# EAGLE schematic UniversalPPU (EAGLE 6.5.0)

## Sheet 1 of 6
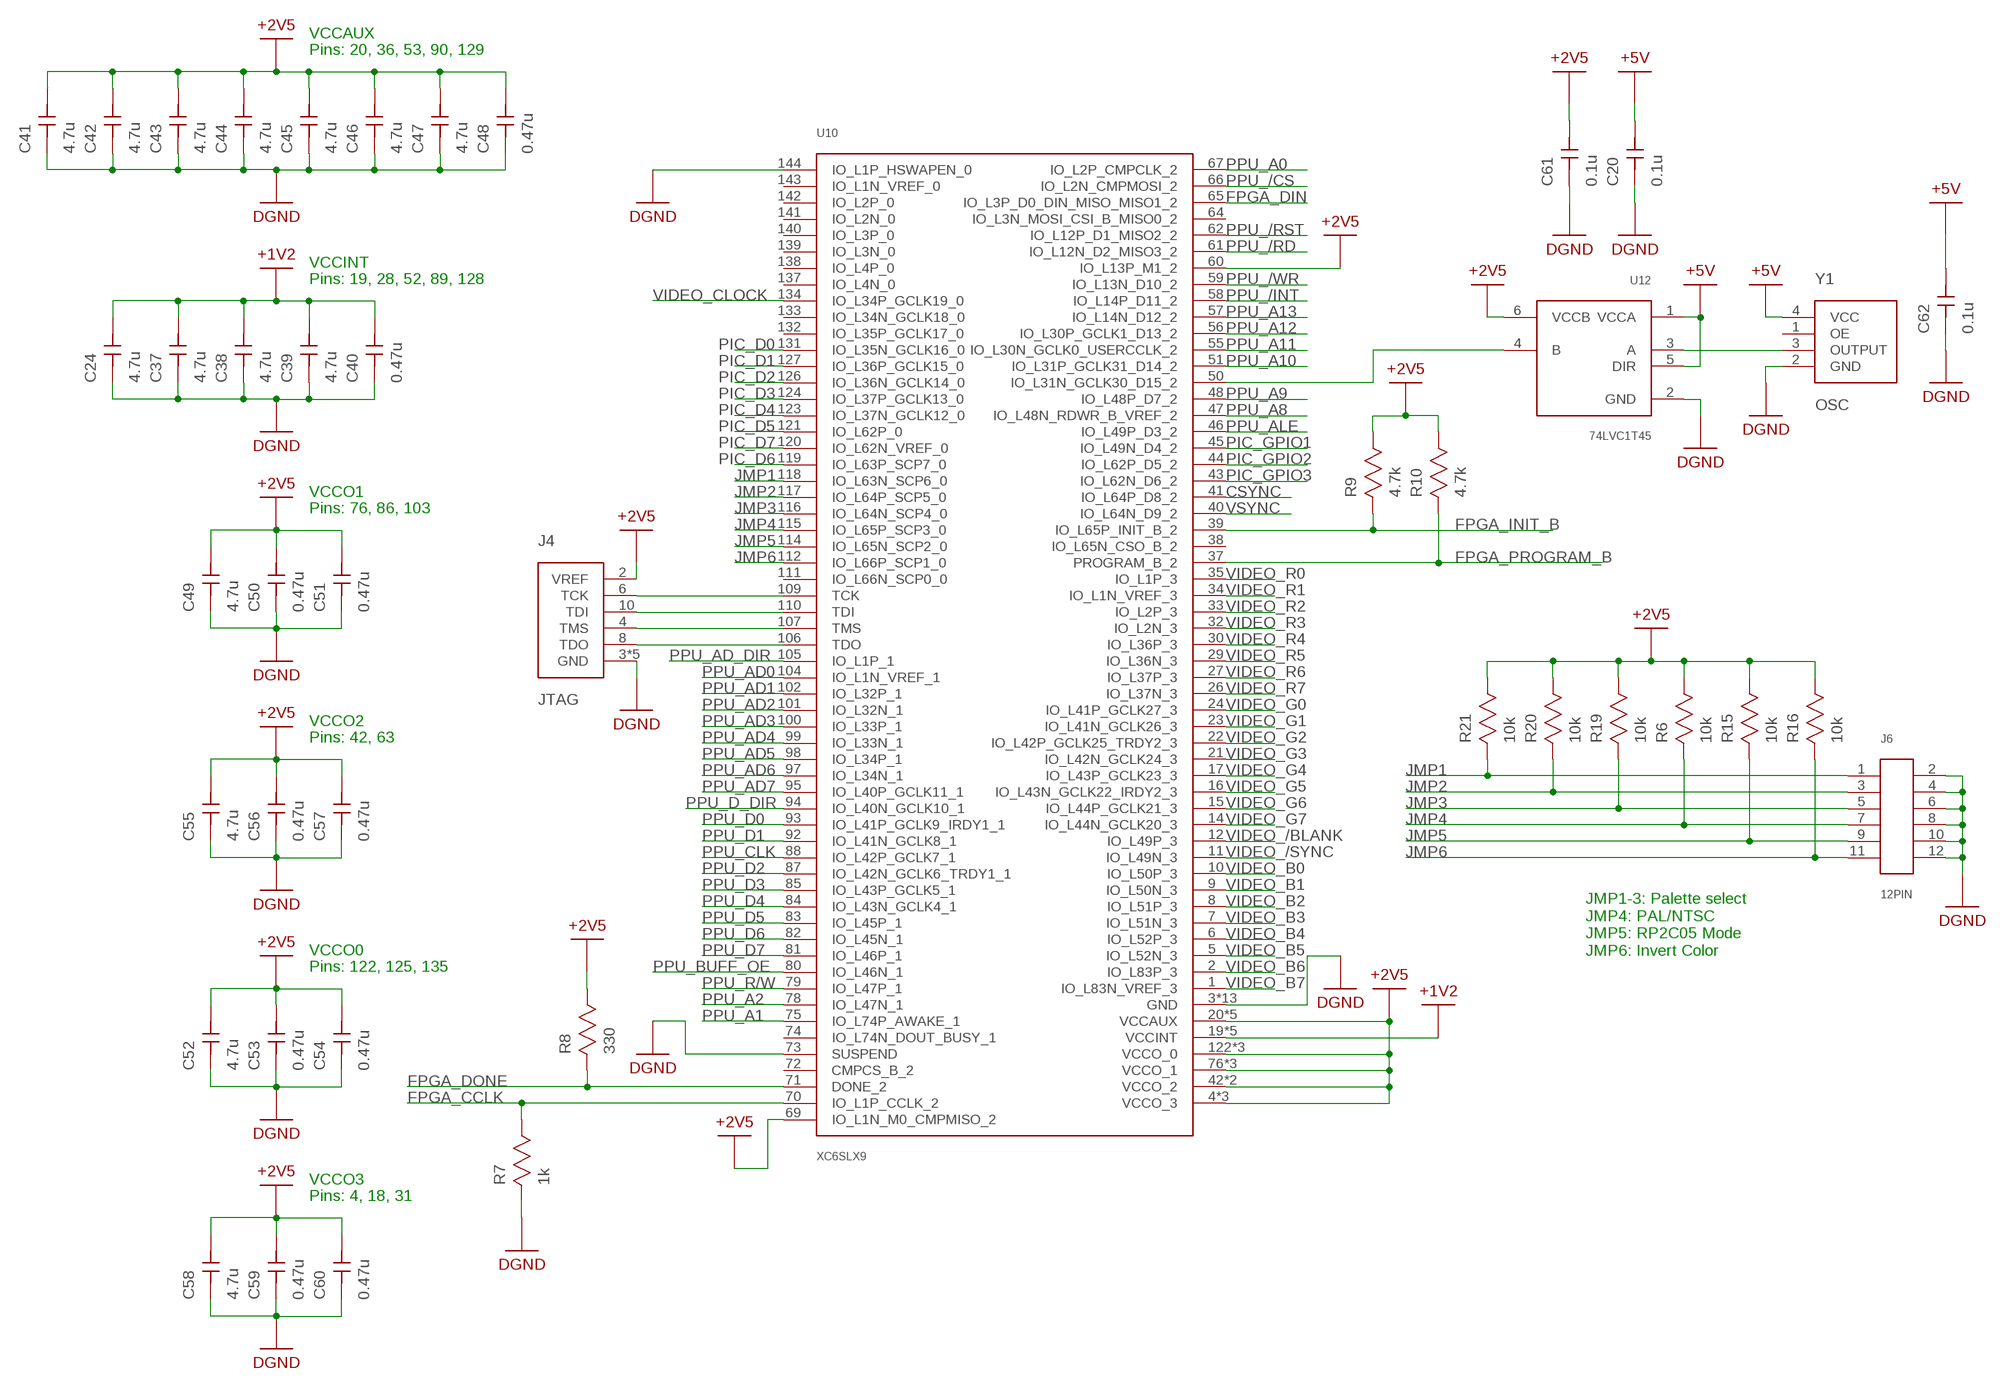
[diagram p0: schematic, sheet 1]

### Parts
C20  0.1u  CAPACITORTDK_C0816  [TDK_C0816]
C24  4.7u  CAPACITORTDK_C0816  [TDK_C0816]
C37  4.7u  CAPACITORTDK_C0816  [TDK_C0816]
C38  4.7u  CAPACITORTDK_C0816  [TDK_C0816]
C39  4.7u  CAPACITORTDK_C0816  [TDK_C0816]
C40  0.47u  CAPACITORTDK_C0816  [TDK_C0816]
C41  4.7u  CAPACITORTDK_C0816  [TDK_C0816]
C42  4.7u  CAPACITORTDK_C0816  [TDK_C0816]
C43  4.7u  CAPACITORTDK_C0816  [TDK_C0816]
C44  4.7u  CAPACITORTDK_C0816  [TDK_C0816]
C45  4.7u  CAPACITORTDK_C0816  [TDK_C0816]
C46  4.7u  CAPACITORTDK_C0816  [TDK_C0816]
C47  4.7u  CAPACITORTDK_C0816  [TDK_C0816]
C48  0.47u  CAPACITORTDK_C0816  [TDK_C0816]
C49  4.7u  CAPACITORTDK_C0816  [TDK_C0816]
C50  0.47u  CAPACITORTDK_C0816  [TDK_C0816]
C51  0.47u  CAPACITORTDK_C0816  [TDK_C0816]
C52  4.7u  CAPACITORTDK_C0816  [TDK_C0816]
C53  0.47u  CAPACITORTDK_C0816  [TDK_C0816]
C54  0.47u  CAPACITORTDK_C0816  [TDK_C0816]
C55  4.7u  CAPACITORTDK_C0816  [TDK_C0816]
C56  0.47u  CAPACITORTDK_C0816  [TDK_C0816]
C57  0.47u  CAPACITORTDK_C0816  [TDK_C0816]
C58  4.7u  CAPACITORTDK_C0816  [TDK_C0816]
C59  0.47u  CAPACITORTDK_C0816  [TDK_C0816]
C60  0.47u  CAPACITORTDK_C0816  [TDK_C0816]
C61  0.1u  CAPACITORTDK_C0816  [TDK_C0816]
C62  0.1u  CAPACITORTDK_C0816  [TDK_C0816]
J4  JTAG  [14PIN_2MM]
J6  12PIN  [12PIN]
R6  10k  RESISTOR0603  [0603]
R7  1k  RESISTOR0603  [0603]
R8  330  RESISTOR0603  [0603]
R9  4.7k  RESISTOR0603  [0603]
R10  4.7k  RESISTOR0603  [0603]
R15  10k  RESISTOR0603  [0603]
R16  10k  RESISTOR0603  [0603]
R19  10k  RESISTOR0603  [0603]
R20  10k  RESISTOR0603  [0603]
R21  10k  RESISTOR0603  [0603]
U10  XC6SLX9  [TQG144]
U12  74LVC1T45  [R-PDSO-G6]
Y1  OSC  [OSC]

### Nets
+1V2: C24.2 C37.2 C38.2 C39.2 C40.2 U10.19(VCCINT) U10.28(VCCINT) U10.52(VCCINT) U10.89(VCCINT) U10.128(VCCINT) ; also sheet 6
+2V5: C41.2 C42.2 C43.2 C44.2 C45.2 C46.2 C47.2 C48.2 C49.2 C50.2 C51.2 C52.2 C53.2 C54.2 C55.2 C56.2 C57.2 C58.2 C59.2 C60.2 C61.2 J4.2(VREF) R6.P$2 R8.P$2 R9.P$2 R10.P$2 R15.P$2 R16.P$2 R19.P$2 R20.P$2 R21.P$2 U10.4(VCCO_3) U10.18(VCCO_3) U10.20(VCCAUX) U10.31(VCCO_3) U10.36(VCCAUX) U10.42(VCCO_2) U10.53(VCCAUX) U10.60(IO_L13P_M1_2) U10.63(VCCO_2) U10.69(IO_L1N_M0_CMPMISO_2) U10.76(VCCO_1) U10.86(VCCO_1) U10.90(VCCAUX) U10.103(VCCO_1) U10.122(VCCO_0) U10.125(VCCO_0) U10.129(VCCAUX) U10.135(VCCO_0) U12.6(VCCB) ; also sheet 2,3,4,5,6
+5V: C20.2 C62.2 U12.1(VCCA) U12.5(DIR) Y1.4(VCC) ; also sheet 2,3,5,6
CSYNC: U10.41(IO_L64P_D8_2) ; also sheet 3
DGND: C20.1 C24.1 C37.1 C38.1 C39.1 C40.1 C41.1 C42.1 C43.1 C44.1 C45.1 C46.1 C47.1 C48.1 C49.1 C50.1 C51.1 C52.1 C53.1 C54.1 C55.1 C56.1 C57.1 C58.1 C59.1 C60.1 C61.1 C62.1 J4.3(GND) J4.5(GND) J4.7(GND) J4.9(GND) J4.11(GND) J6.2 J6.4 J6.6 J6.8 J6.10 J6.12 R7.P$1 U10.3(GND) U10.13(GND) U10.25(GND) U10.49(GND) U10.54(GND) U10.68(GND) U10.73(SUSPEND) U10.77(GND) U10.91(GND) U10.96(GND) U10.108(GND) U10.113(GND) U10.130(GND) U10.136(GND) U10.144(IO_L1P_HSWAPEN_0) U12.2(GND) Y1.2(GND) ; also sheet 2,3,4,5,6
FPGA_CCLK: R7.P$2 U10.70(IO_L1P_CCLK_2) ; also sheet 4
FPGA_DIN: U10.65(IO_L3P_D0_DIN_MISO_MISO1_2) ; also sheet 4
FPGA_DONE: R8.P$1 U10.71(DONE_2) ; also sheet 4
FPGA_INIT_B: R9.P$1 U10.39(IO_L65P_INIT_B_2) ; also sheet 4
FPGA_PROGRAM_B: R10.P$1 U10.37(PROGRAM_B_2) ; also sheet 4
JMP1: J6.1 R21.P$1 U10.118(IO_L63N_SCP6_0)
JMP2: J6.3 R20.P$1 U10.117(IO_L64P_SCP5_0)
JMP3: J6.5 R19.P$1 U10.116(IO_L64N_SCP4_0)
JMP4: J6.7 R6.P$1 U10.115(IO_L65P_SCP3_0)
JMP5: J6.9 R15.P$1 U10.114(IO_L65N_SCP2_0)
JMP6: J6.11 R16.P$1 U10.112(IO_L66P_SCP1_0)
N$3: U10.50(IO_L31N_GCLK30_D15_2) U12.4(B)
N$23: U12.3(A) Y1.3(OUTPUT)
PIC_D0: U10.131(IO_L35N_GCLK16_0) ; also sheet 4
PIC_D1: U10.127(IO_L36P_GCLK15_0) ; also sheet 4
PIC_D2: U10.126(IO_L36N_GCLK14_0) ; also sheet 4
PIC_D3: U10.124(IO_L37P_GCLK13_0) ; also sheet 4
PIC_D4: U10.123(IO_L37N_GCLK12_0) ; also sheet 4
PIC_D5: U10.121(IO_L62P_0) ; also sheet 4
PIC_D6: U10.119(IO_L63P_SCP7_0) ; also sheet 4
PIC_D7: U10.120(IO_L62N_VREF_0) ; also sheet 4
PIC_GPIO1: U10.45(IO_L49N_D4_2) ; also sheet 4
PIC_GPIO2: U10.44(IO_L62P_D5_2) ; also sheet 4
PIC_GPIO3: U10.43(IO_L62N_D6_2) ; also sheet 4
PPU_/CS: U10.66(IO_L2N_CMPMOSI_2) ; also sheet 2
PPU_/INT: U10.58(IO_L14P_D11_2) ; also sheet 2
PPU_/RD: U10.61(IO_L12N_D2_MISO3_2) ; also sheet 2
PPU_/RST: U10.62(IO_L12P_D1_MISO2_2) ; also sheet 2
PPU_/WR: U10.59(IO_L13N_D10_2) ; also sheet 2
PPU_A0: U10.67(IO_L2P_CMPCLK_2) ; also sheet 2
PPU_A1: U10.75(IO_L74P_AWAKE_1) ; also sheet 2
PPU_A2: U10.78(IO_L47N_1) ; also sheet 2
PPU_A8: U10.47(IO_L48N_RDWR_B_VREF_2) ; also sheet 2
PPU_A9: U10.48(IO_L48P_D7_2) ; also sheet 2
PPU_A10: U10.51(IO_L31P_GCLK31_D14_2) ; also sheet 2
PPU_A11: U10.55(IO_L30N_GCLK0_USERCCLK_2) ; also sheet 2
PPU_A12: U10.56(IO_L30P_GCLK1_D13_2) ; also sheet 2
PPU_A13: U10.57(IO_L14N_D12_2) ; also sheet 2
PPU_AD0: U10.104(IO_L1N_VREF_1) ; also sheet 2
PPU_AD1: U10.102(IO_L32P_1) ; also sheet 2
PPU_AD2: U10.101(IO_L32N_1) ; also sheet 2
PPU_AD3: U10.100(IO_L33P_1) ; also sheet 2
PPU_AD4: U10.99(IO_L33N_1) ; also sheet 2
PPU_AD5: U10.98(IO_L34P_1) ; also sheet 2
PPU_AD6: U10.97(IO_L34N_1) ; also sheet 2
PPU_AD7: U10.95(IO_L40P_GCLK11_1) ; also sheet 2
PPU_AD_DIR: U10.105(IO_L1P_1) ; also sheet 2
PPU_ALE: U10.46(IO_L49P_D3_2) ; also sheet 2
PPU_BUFF_OE: U10.80(IO_L46N_1) ; also sheet 2
PPU_CLK: U10.88(IO_L42P_GCLK7_1) ; also sheet 2
PPU_D0: U10.93(IO_L41P_GCLK9_IRDY1_1) ; also sheet 2
PPU_D1: U10.92(IO_L41N_GCLK8_1) ; also sheet 2
PPU_D2: U10.87(IO_L42N_GCLK6_TRDY1_1) ; also sheet 2
PPU_D3: U10.85(IO_L43P_GCLK5_1) ; also sheet 2
PPU_D4: U10.84(IO_L43N_GCLK4_1) ; also sheet 2
PPU_D5: U10.83(IO_L45P_1) ; also sheet 2
PPU_D6: U10.82(IO_L45N_1) ; also sheet 2
PPU_D7: U10.81(IO_L46P_1) ; also sheet 2
PPU_D_DIR: U10.94(IO_L40N_GCLK10_1) ; also sheet 2
PPU_R/W: U10.79(IO_L47P_1) ; also sheet 2
TCK: J4.6(TCK) U10.109(TCK)
TDI: J4.10(TDI) U10.110(TDI)
TDO: J4.8(TDO) U10.106(TDO)
TMS: J4.4(TMS) U10.107(TMS)
VIDEO_/BLANK: U10.12(IO_L49P_3) ; also sheet 3
VIDEO_/SYNC: U10.11(IO_L49N_3) ; also sheet 3
VIDEO_B0: U10.10(IO_L50P_3) ; also sheet 3
VIDEO_B1: U10.9(IO_L50N_3) ; also sheet 3
VIDEO_B2: U10.8(IO_L51P_3) ; also sheet 3
VIDEO_B3: U10.7(IO_L51N_3) ; also sheet 3
VIDEO_B4: U10.6(IO_L52P_3) ; also sheet 3
VIDEO_B5: U10.5(IO_L52N_3) ; also sheet 3
VIDEO_B6: U10.2(IO_L83P_3) ; also sheet 3
VIDEO_B7: U10.1(IO_L83N_VREF_3) ; also sheet 3
VIDEO_CLOCK: U10.134(IO_L34P_GCLK19_0) ; also sheet 3
VIDEO_G0: U10.24(IO_L41P_GCLK27_3) ; also sheet 3
VIDEO_G1: U10.23(IO_L41N_GCLK26_3) ; also sheet 3
VIDEO_G2: U10.22(IO_L42P_GCLK25_TRDY2_3) ; also sheet 3
VIDEO_G3: U10.21(IO_L42N_GCLK24_3) ; also sheet 3
VIDEO_G4: U10.17(IO_L43P_GCLK23_3) ; also sheet 3
VIDEO_G5: U10.16(IO_L43N_GCLK22_IRDY2_3) ; also sheet 3
VIDEO_G6: U10.15(IO_L44P_GCLK21_3) ; also sheet 3
VIDEO_G7: U10.14(IO_L44N_GCLK20_3) ; also sheet 3
VIDEO_R0: U10.35(IO_L1P_3) ; also sheet 3
VIDEO_R1: U10.34(IO_L1N_VREF_3) ; also sheet 3
VIDEO_R2: U10.33(IO_L2P_3) ; also sheet 3
VIDEO_R3: U10.32(IO_L2N_3) ; also sheet 3
VIDEO_R4: U10.30(IO_L36P_3) ; also sheet 3
VIDEO_R5: U10.29(IO_L36N_3) ; also sheet 3
VIDEO_R6: U10.27(IO_L37P_3) ; also sheet 3
VIDEO_R7: U10.26(IO_L37N_3) ; also sheet 3
VSYNC: U10.40(IO_L64N_D9_2) ; also sheet 3
Unconnected: U10.38(IO_L65N_CSO_B_2) U10.64(IO_L3N_MOSI_CSI_B_MISO0_2) U10.72(CMPCS_B_2) U10.74(IO_L74N_DOUT_BUSY_1) U10.111(IO_L66N_SCP0_0) U10.132(IO_L35P_GCLK17_0) U10.133(IO_L34N_GCLK18_0) U10.137(IO_L4N_0) U10.138(IO_L4P_0) U10.139(IO_L3N_0) U10.140(IO_L3P_0) U10.141(IO_L2N_0) U10.142(IO_L2P_0) U10.143(IO_L1N_VREF_0) Y1.1(OE)

### Notes on the sheet
- VCCAUX
- Pins: 20, 36, 53, 90, 129
- VCCINT
- Pins: 19, 28, 52, 89, 128
- VCCO1
- Pins: 76, 86, 103
- VCCO2
- Pins: 42, 63
- VCCO0
- JMP1-3: Palette select
  JMP4: PAL/NTSC
  JMP5: RP2C05 Mode
  JMP6: Invert Color
- Pins: 122, 125, 135
- VCCO3
- Pins: 4, 18, 31

## Sheet 2 of 6
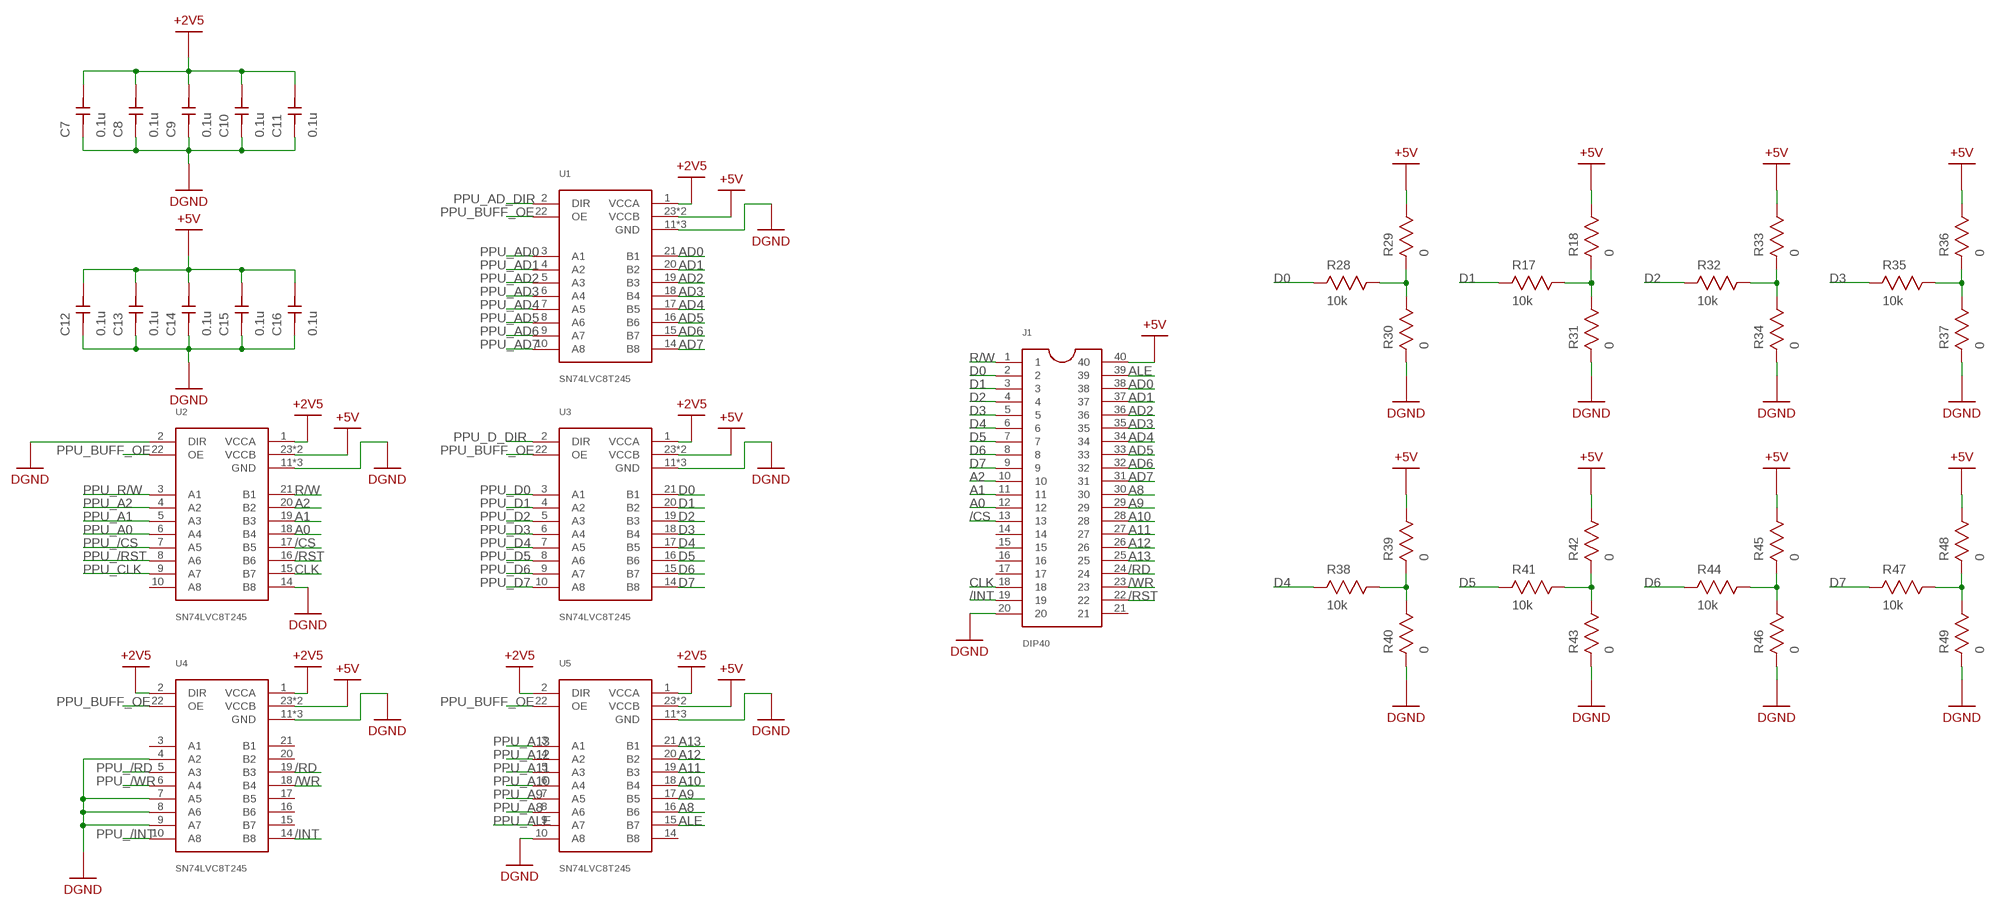
[diagram p1: schematic, sheet 2]

### Parts
C7  0.1u  CAPACITORTDK_C0816  [TDK_C0816]
C8  0.1u  CAPACITORTDK_C0816  [TDK_C0816]
C9  0.1u  CAPACITORTDK_C0816  [TDK_C0816]
C10  0.1u  CAPACITORTDK_C0816  [TDK_C0816]
C11  0.1u  CAPACITORTDK_C0816  [TDK_C0816]
C12  0.1u  CAPACITORTDK_C0816  [TDK_C0816]
C13  0.1u  CAPACITORTDK_C0816  [TDK_C0816]
C14  0.1u  CAPACITORTDK_C0816  [TDK_C0816]
C15  0.1u  CAPACITORTDK_C0816  [TDK_C0816]
C16  0.1u  CAPACITORTDK_C0816  [TDK_C0816]
J1  DIP40  [DIP40]
R17  10k  RESISTOR0603  [0603]
R18  0  RESISTOR0603  [0603]
R28  10k  RESISTOR0603  [0603]
R29  0  RESISTOR0603  [0603]
R30  0  RESISTOR0603  [0603]
R31  0  RESISTOR0603  [0603]
R32  10k  RESISTOR0603  [0603]
R33  0  RESISTOR0603  [0603]
R34  0  RESISTOR0603  [0603]
R35  10k  RESISTOR0603  [0603]
R36  0  RESISTOR0603  [0603]
R37  0  RESISTOR0603  [0603]
R38  10k  RESISTOR0603  [0603]
R39  0  RESISTOR0603  [0603]
R40  0  RESISTOR0603  [0603]
R41  10k  RESISTOR0603  [0603]
R42  0  RESISTOR0603  [0603]
R43  0  RESISTOR0603  [0603]
R44  10k  RESISTOR0603  [0603]
R45  0  RESISTOR0603  [0603]
R46  0  RESISTOR0603  [0603]
R47  10k  RESISTOR0603  [0603]
R48  0  RESISTOR0603  [0603]
R49  0  RESISTOR0603  [0603]
U1  SN74LVC8T245  [TSSOP24]
U2  SN74LVC8T245  [TSSOP24]
U3  SN74LVC8T245  [TSSOP24]
U4  SN74LVC8T245  [TSSOP24]
U5  SN74LVC8T245  [TSSOP24]

### Nets
+2V5: C7.2 C8.2 C9.2 C10.2 C11.2 U1.1(VCCA) U2.1(VCCA) U3.1(VCCA) U4.1(VCCA) U4.2(DIR) U5.1(VCCA) U5.2(DIR) ; also sheet 1,3,4,5,6
+5V: C12.2 C13.2 C14.2 C15.2 C16.2 J1.40 R18.P$2 R29.P$2 R33.P$2 R36.P$2 R39.P$2 R42.P$2 R45.P$2 R48.P$2 U1.23(VCCB) U1.24(VCCB) U2.23(VCCB) U2.24(VCCB) U3.23(VCCB) U3.24(VCCB) U4.23(VCCB) U4.24(VCCB) U5.23(VCCB) U5.24(VCCB) ; also sheet 1,3,5,6
/CS: J1.13 U2.17(B5)
/INT: J1.19 U4.14(B8)
/RD: J1.24 U4.19(B3)
/RST: J1.22 U2.16(B6)
/WR: J1.23 U4.18(B4)
A0: J1.12 U2.18(B4)
A1: J1.11 U2.19(B3)
A2: J1.10 U2.20(B2)
A8: J1.30 U5.16(B6)
A9: J1.29 U5.17(B5)
A10: J1.28 U5.18(B4)
A11: J1.27 U5.19(B3)
A12: J1.26 U5.20(B2)
A13: J1.25 U5.21(B1)
AD0: J1.38 U1.21(B1)
AD1: J1.37 U1.20(B2)
AD2: J1.36 U1.19(B3)
AD3: J1.35 U1.18(B4)
AD4: J1.34 U1.17(B5)
AD5: J1.33 U1.16(B6)
AD6: J1.32 U1.15(B7)
AD7: J1.31 U1.14(B8)
ALE: J1.39 U5.15(B7)
CLK: J1.18 U2.15(B7)
D0: J1.2 R28.P$1 U3.21(B1)
D1: J1.3 R17.P$1 U3.20(B2)
D2: J1.4 R32.P$1 U3.19(B3)
D3: J1.5 R35.P$1 U3.18(B4)
D4: J1.6 R38.P$1 U3.17(B5)
D5: J1.7 R41.P$1 U3.16(B6)
D6: J1.8 R44.P$1 U3.15(B7)
D7: J1.9 R47.P$1 U3.14(B8)
DGND: C7.1 C8.1 C9.1 C10.1 C11.1 C12.1 C13.1 C14.1 C15.1 C16.1 J1.20 R30.P$1 R31.P$1 R34.P$1 R37.P$1 R40.P$1 R43.P$1 R46.P$1 R49.P$1 U1.11(GND) U1.12(GND) U1.13(GND) U2.2(DIR) U2.11(GND) U2.12(GND) U2.13(GND) U2.14(B8) U3.11(GND) U3.12(GND) U3.13(GND) U4.4(A2) U4.7(A5) U4.8(A6) U4.9(A7) U4.11(GND) U4.12(GND) U4.13(GND) U5.10(A8) U5.11(GND) U5.12(GND) U5.13(GND) ; also sheet 1,3,4,5,6
N$20: R28.P$2 R29.P$1 R30.P$2
N$21: R17.P$2 R18.P$1 R31.P$2
N$22: R32.P$2 R33.P$1 R34.P$2
N$32: R35.P$2 R36.P$1 R37.P$2
N$38: R38.P$2 R39.P$1 R40.P$2
N$39: R41.P$2 R42.P$1 R43.P$2
N$40: R44.P$2 R45.P$1 R46.P$2
N$41: R47.P$2 R48.P$1 R49.P$2
PPU_/CS: U2.7(A5) ; also sheet 1
PPU_/INT: U4.10(A8) ; also sheet 1
PPU_/RD: U4.5(A3) ; also sheet 1
PPU_/RST: U2.8(A6) ; also sheet 1
PPU_/WR: U4.6(A4) ; also sheet 1
PPU_A0: U2.6(A4) ; also sheet 1
PPU_A1: U2.5(A3) ; also sheet 1
PPU_A2: U2.4(A2) ; also sheet 1
PPU_A8: U5.8(A6) ; also sheet 1
PPU_A9: U5.7(A5) ; also sheet 1
PPU_A10: U5.6(A4) ; also sheet 1
PPU_A11: U5.5(A3) ; also sheet 1
PPU_A12: U5.4(A2) ; also sheet 1
PPU_A13: U5.3(A1) ; also sheet 1
PPU_AD0: U1.3(A1) ; also sheet 1
PPU_AD1: U1.4(A2) ; also sheet 1
PPU_AD2: U1.5(A3) ; also sheet 1
PPU_AD3: U1.6(A4) ; also sheet 1
PPU_AD4: U1.7(A5) ; also sheet 1
PPU_AD5: U1.8(A6) ; also sheet 1
PPU_AD6: U1.9(A7) ; also sheet 1
PPU_AD7: U1.10(A8) ; also sheet 1
PPU_AD_DIR: U1.2(DIR) ; also sheet 1
PPU_ALE: U5.9(A7) ; also sheet 1
PPU_BUFF_OE: U1.22(OE) U2.22(OE) U3.22(OE) U4.22(OE) U5.22(OE) ; also sheet 1
PPU_CLK: U2.9(A7) ; also sheet 1
PPU_D0: U3.3(A1) ; also sheet 1
PPU_D1: U3.4(A2) ; also sheet 1
PPU_D2: U3.5(A3) ; also sheet 1
PPU_D3: U3.6(A4) ; also sheet 1
PPU_D4: U3.7(A5) ; also sheet 1
PPU_D5: U3.8(A6) ; also sheet 1
PPU_D6: U3.9(A7) ; also sheet 1
PPU_D7: U3.10(A8) ; also sheet 1
PPU_D_DIR: U3.2(DIR) ; also sheet 1
PPU_R/W: U2.3(A1) ; also sheet 1
R/W: J1.1 U2.21(B1)
Unconnected: J1.14 J1.15 J1.16 J1.17 J1.21 U2.10(A8) U4.3(A1) U4.15(B7) U4.16(B6) U4.17(B5) U4.20(B2) U4.21(B1) U5.14(B8)

## Sheet 3 of 6
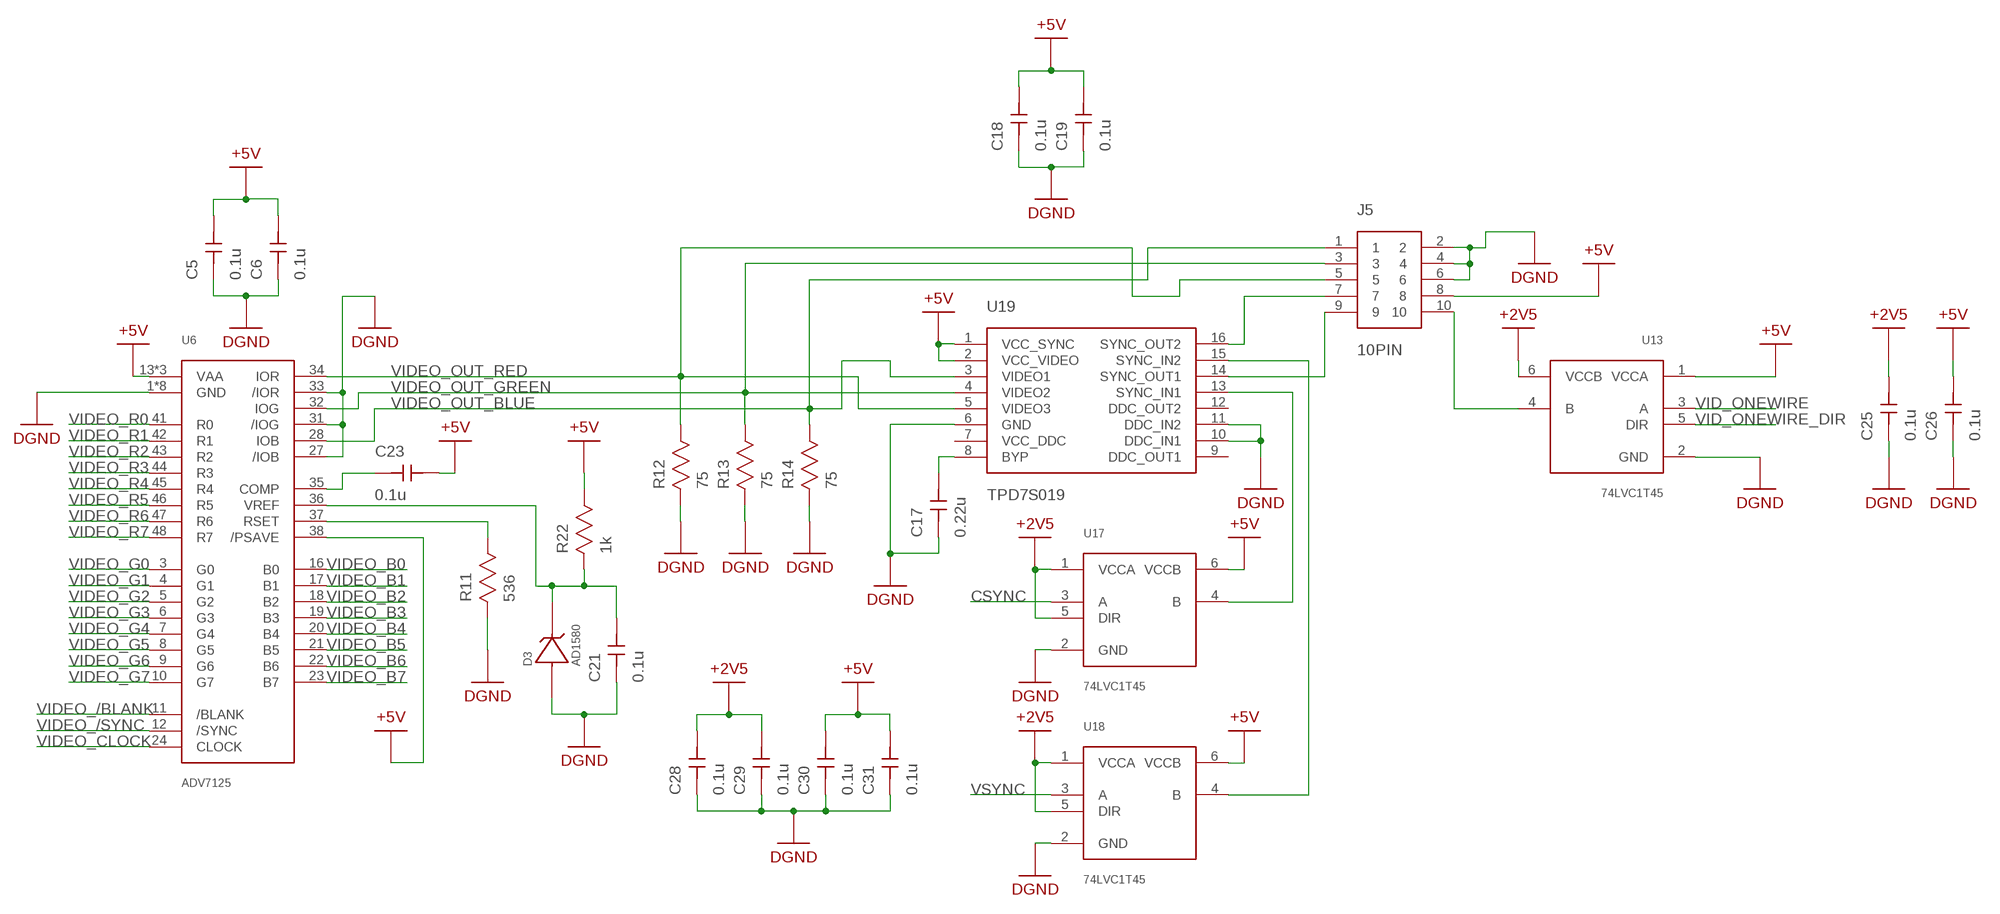
[diagram p2: schematic, sheet 3]

### Parts
C5  0.1u  CAPACITORTDK_C0816  [TDK_C0816]
C6  0.1u  CAPACITORTDK_C0816  [TDK_C0816]
C17  0.22u  CAPACITORTDK_C0816  [TDK_C0816]
C18  0.1u  CAPACITORTDK_C0816  [TDK_C0816]
C19  0.1u  CAPACITORTDK_C0816  [TDK_C0816]
C21  0.1u  CAPACITORTDK_C0816  [TDK_C0816]
C23  0.1u  CAPACITORTDK_C0816  [TDK_C0816]
C25  0.1u  CAPACITORTDK_C0816  [TDK_C0816]
C26  0.1u  CAPACITORTDK_C0816  [TDK_C0816]
C28  0.1u  CAPACITORTDK_C0816  [TDK_C0816]
C29  0.1u  CAPACITORTDK_C0816  [TDK_C0816]
C30  0.1u  CAPACITORTDK_C0816  [TDK_C0816]
C31  0.1u  CAPACITORTDK_C0816  [TDK_C0816]
D3  AD1580  [SOT-23-3]
J5  10PIN  [10PIN]
R11  536  RESISTOR0603  [0603]
R12  75  RESISTOR0603  [0603]
R13  75  RESISTOR0603  [0603]
R14  75  RESISTOR0603  [0603]
R22  1k  RESISTOR0603  [0603]
U6  ADV7125  [LQFP-48]
U13  74LVC1T45  [R-PDSO-G6]
U17  74LVC1T45  [R-PDSO-G6]
U18  74LVC1T45  [R-PDSO-G6]
U19  TPD7S019  [R-PDSO-G16]

### Nets
+2V5: C25.2 C28.2 C29.2 U13.6(VCCB) U17.1(VCCA) U17.5(DIR) U18.1(VCCA) U18.5(DIR) ; also sheet 1,2,4,5,6
+5V: C5.2 C6.2 C18.2 C19.2 C23.2 C26.2 C30.2 C31.2 J5.8 R22.P$2 U6.13(VAA) U6.29(VAA) U6.30(VAA) U6.38(/PSAVE) U13.1(VCCA) U17.6(VCCB) U18.6(VCCB) U19.1(VCC_SYNC) U19.2(VCC_VIDEO) ; also sheet 1,2,5,6
CSYNC: U17.3(A) ; also sheet 1
DGND: C5.1 C6.1 C17.1 C18.1 C19.1 C21.1 C25.1 C26.1 C28.1 C29.1 C30.1 C31.1 D3.2(V-) J5.2 J5.4 J5.6 R11.P$1 R12.P$1 R13.P$1 R14.P$1 U6.1(GND) U6.2(GND) U6.14(GND) U6.15(GND) U6.25(GND) U6.26(GND) U6.27(/IOB) U6.31(/IOG) U6.33(/IOR) U6.39(GND) U6.40(GND) U13.2(GND) U17.2(GND) U18.2(GND) U19.6(GND) U19.10(DDC_IN1) U19.11(DDC_IN2) ; also sheet 1,2,4,5,6
N$1: C23.1 U6.35(COMP)
N$14: U17.4(B) U19.13(SYNC_IN1)
N$17: C21.2 D3.1(V+) R22.P$1 U6.36(VREF)
N$19: R11.P$2 U6.37(RSET)
N$24: J5.10 U13.4(B)
N$33: C17.2 U19.8(BYP)
N$35: U18.4(B) U19.15(SYNC_IN2)
N$36: J5.7 U19.16(SYNC_OUT2)
N$37: J5.9 U19.14(SYNC_OUT1)
VID_ONEWIRE: U13.3(A) ; also sheet 4
VID_ONEWIRE_DIR: U13.5(DIR) ; also sheet 4
VIDEO_/BLANK: U6.11(/BLANK) ; also sheet 1
VIDEO_/SYNC: U6.12(/SYNC) ; also sheet 1
VIDEO_B0: U6.16(B0) ; also sheet 1
VIDEO_B1: U6.17(B1) ; also sheet 1
VIDEO_B2: U6.18(B2) ; also sheet 1
VIDEO_B3: U6.19(B3) ; also sheet 1
VIDEO_B4: U6.20(B4) ; also sheet 1
VIDEO_B5: U6.21(B5) ; also sheet 1
VIDEO_B6: U6.22(B6) ; also sheet 1
VIDEO_B7: U6.23(B7) ; also sheet 1
VIDEO_CLOCK: U6.24(CLOCK) ; also sheet 1
VIDEO_G0: U6.3(G0) ; also sheet 1
VIDEO_G1: U6.4(G1) ; also sheet 1
VIDEO_G2: U6.5(G2) ; also sheet 1
VIDEO_G3: U6.6(G3) ; also sheet 1
VIDEO_G4: U6.7(G4) ; also sheet 1
VIDEO_G5: U6.8(G5) ; also sheet 1
VIDEO_G6: U6.9(G6) ; also sheet 1
VIDEO_G7: U6.10(G7) ; also sheet 1
VIDEO_OUT_BLUE: J5.1 R14.P$2 U6.28(IOB) U19.3(VIDEO1)
VIDEO_OUT_GREEN: J5.3 R13.P$2 U6.32(IOG) U19.4(VIDEO2)
VIDEO_OUT_RED: J5.5 R12.P$2 U6.34(IOR) U19.5(VIDEO3)
VIDEO_R0: U6.41(R0) ; also sheet 1
VIDEO_R1: U6.42(R1) ; also sheet 1
VIDEO_R2: U6.43(R2) ; also sheet 1
VIDEO_R3: U6.44(R3) ; also sheet 1
VIDEO_R4: U6.45(R4) ; also sheet 1
VIDEO_R5: U6.46(R5) ; also sheet 1
VIDEO_R6: U6.47(R6) ; also sheet 1
VIDEO_R7: U6.48(R7) ; also sheet 1
VSYNC: U18.3(A) ; also sheet 1
Unconnected: U19.7(VCC_DDC) U19.9(DDC_OUT1) U19.12(DDC_OUT2)

## Sheet 4 of 6
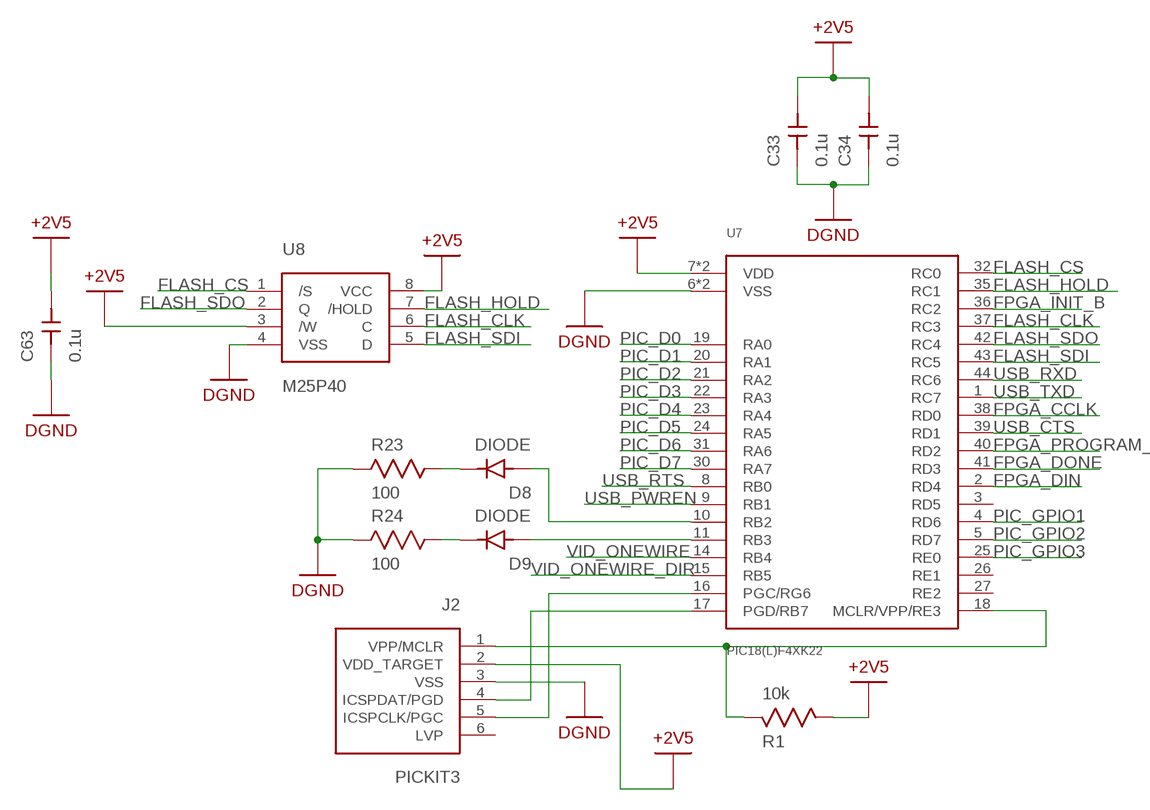
[diagram p3: schematic, sheet 4]

### Parts
C33  0.1u  CAPACITORTDK_C0816  [TDK_C0816]
C34  0.1u  CAPACITORTDK_C0816  [TDK_C0816]
C63  0.1u  CAPACITORTDK_C0816  [TDK_C0816]
D8  DIODE  [LED_0603]
D9  DIODE  [LED_0603]
J2  PICKIT3  [6SIP]
R1  10k  RESISTOR0603  [0603]
R23  100  RESISTOR0603  [0603]
R24  100  RESISTOR0603  [0603]
U7  PIC18(L)F4XK22  [TQFP44]
U8  M25P40  [8PIN]

### Nets
+2V5: C33.2 C34.2 C63.2 J2.2(VDD_TARGET) R1.P$2 U7.7(VDD) U7.28(VDD) U8.3(/W) U8.8(VCC) ; also sheet 1,2,3,5,6
DGND: C33.1 C34.1 C63.1 J2.3(VSS) R23.P$1 R24.P$1 U7.6(VSS) U7.29(VSS) U8.4(VSS) ; also sheet 1,2,3,5,6
FLASH_CLK: U7.37(RC3) U8.6(C)
FLASH_CS: U7.32(RC0) U8.1(/S)
FLASH_HOLD: U7.35(RC1) U8.7(/HOLD)
FLASH_SDI: U7.43(RC5) U8.5(D)
FLASH_SDO: U7.42(RC4) U8.2(Q)
FPGA_CCLK: U7.38(RD0) ; also sheet 1
FPGA_DIN: U7.2(RD4) ; also sheet 1
FPGA_DONE: U7.41(RD3) ; also sheet 1
FPGA_INIT_B: U7.36(RC2) ; also sheet 1
FPGA_PROGRAM_B: U7.40(RD2) ; also sheet 1
N$11: J2.4(ICSPDAT/PGD) U7.17(PGD/RB7)
N$12: J2.1(VPP/MCLR) R1.P$1 U7.18(MCLR/VPP/RE3)
N$13: J2.5(ICSPCLK/PGC) U7.16(PGC/RG6)
N$28: D8.A U7.10(RB2)
N$29: D9.A U7.11(RB3)
N$30: D8.C R23.P$2
N$31: D9.C R24.P$2
PIC_D0: U7.19(RA0) ; also sheet 1
PIC_D1: U7.20(RA1) ; also sheet 1
PIC_D2: U7.21(RA2) ; also sheet 1
PIC_D3: U7.22(RA3) ; also sheet 1
PIC_D4: U7.23(RA4) ; also sheet 1
PIC_D5: U7.24(RA5) ; also sheet 1
PIC_D6: U7.31(RA6) ; also sheet 1
PIC_D7: U7.30(RA7) ; also sheet 1
PIC_GPIO1: U7.4(RD6) ; also sheet 1
PIC_GPIO2: U7.5(RD7) ; also sheet 1
PIC_GPIO3: U7.25(RE0) ; also sheet 1
USB_CTS: U7.39(RD1) ; also sheet 5
USB_PWREN: U7.9(RB1) ; also sheet 5
USB_RTS: U7.8(RB0) ; also sheet 5
USB_RXD: U7.44(RC6) ; also sheet 5
USB_TXD: U7.1(RC7) ; also sheet 5
VID_ONEWIRE: U7.14(RB4) ; also sheet 3
VID_ONEWIRE_DIR: U7.15(RB5) ; also sheet 3
Unconnected: J2.6(LVP) U7.3(RD5) U7.26(RE1) U7.27(RE2)

## Sheet 5 of 6
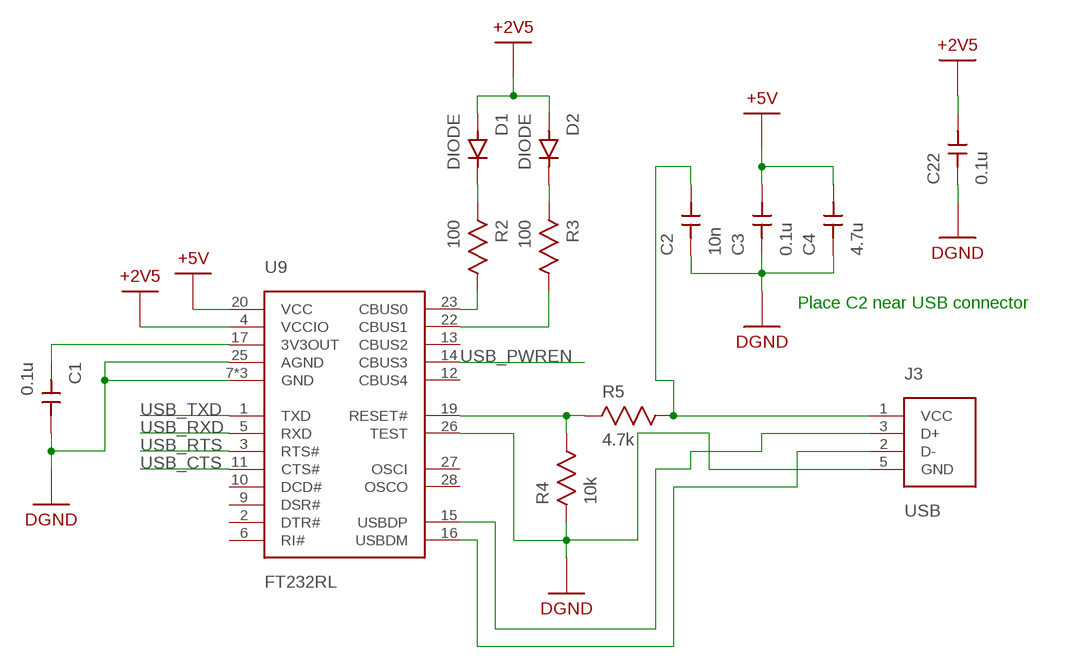
[diagram p4: schematic, sheet 5]

### Parts
C1  0.1u  CAPACITORTDK_C0816  [TDK_C0816]
C2  10n  CAPACITORTDK_C0816  [TDK_C0816]
C3  0.1u  CAPACITORTDK_C0816  [TDK_C0816]
C4  4.7u  CAPACITORTDK_C0816  [TDK_C0816]
C22  0.1u  CAPACITORTDK_C0816  [TDK_C0816]
D1  DIODE  [LED_0603]
D2  DIODE  [LED_0603]
J3  USB  [USB]
R2  100  RESISTOR0603  [0603]
R3  100  RESISTOR0603  [0603]
R4  10k  RESISTOR0603  [0603]
R5  4.7k  RESISTOR0603  [0603]
U9  FT232RL  [SSOP-28]

### Nets
+2V5: C22.2 D1.A D2.A U9.4(VCCIO) ; also sheet 1,2,3,4,6
+5V: C3.2 C4.2 U9.20(VCC) ; also sheet 1,2,3,6
DGND: C1.2 C2.1 C3.1 C4.1 C22.1 J3.5(GND) R4.P$1 U9.7(GND) U9.18(GND) U9.21(GND) U9.25(AGND) U9.26(TEST) ; also sheet 1,2,3,4,6
N$2: R4.P$2 R5.P$1 U9.19(RESET#)
N$4: J3.3(D+) U9.15(USBDP)
N$5: C1.1 U9.17(3V3OUT)
N$6: R2.P$2 U9.23(CBUS0)
N$7: R3.P$2 U9.22(CBUS1)
N$8: J3.2(D-) U9.16(USBDM)
N$9: D1.C R2.P$1
N$10: D2.C R3.P$1
N$15: C2.2 J3.1(VCC) R5.P$2
USB_CTS: U9.11(CTS#) ; also sheet 4
USB_PWREN: U9.14(CBUS3) ; also sheet 4
USB_RTS: U9.3(RTS#) ; also sheet 4
USB_RXD: U9.5(RXD) ; also sheet 4
USB_TXD: U9.1(TXD) ; also sheet 4
Unconnected: U9.2(DTR#) U9.6(RI#) U9.9(DSR#) U9.10(DCD#) U9.12(CBUS4) U9.13(CBUS2) U9.27(OSCI) U9.28(OSCO)

### Notes on the sheet
- Place C2 near USB connector

## Sheet 6 of 6
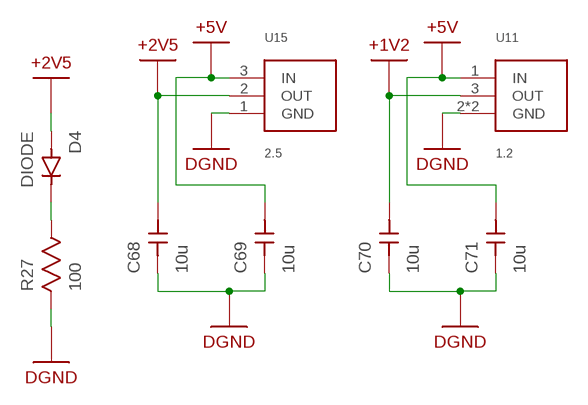
[diagram p5: schematic, sheet 6]

### Parts
C68  10u  CAPACITORTDK_C1632  [TDK_C1632]
C69  10u  CAPACITORTDK_C1632  [TDK_C1632]
C70  10u  CAPACITORTDK_C1632  [TDK_C1632]
C71  10u  CAPACITORTDK_C1632  [TDK_C1632]
D4  DIODE  [LED_0603]
R27  100  RESISTOR0603  [0603]
U11  1.2  NCP566  [SOT-223]
U15  2.5  NCP1117  [SOT-223]

### Nets
+1V2: C70.2 U11.3(OUT) ; also sheet 1
+2V5: C68.2 D4.A U15.2(OUT) ; also sheet 1,2,3,4,5
+5V: C69.2 C71.2 U11.1(IN) U15.3(IN) ; also sheet 1,2,3,5
DGND: C68.1 C69.1 C70.1 C71.1 R27.P$1 U11.2(GND) U11.4(GND) U15.1(GND) ; also sheet 1,2,3,4,5
N$18: D4.C R27.P$2

## Library data of the parts
C1-C26 C28-C31 C33 C34 C37-C63 C68-C71 = Standard:CAPACITOR
D1 D2 D4 D8 D9 = Standard:DIODE
D3 = Analog:AD1580
J1 = Connector:DIP40
J2 = Microchip:PICKIT3
J3 = Wurth Elektronik:USB
J4 = Xilinx:JTAG
J5 = Connector:10PIN
J6 = Connector:12PIN
R1-R24 R27-R49 = Standard:RESISTOR
U1-U5 = Texas Instruments:SN74LVC8T245
U6 = Analog:ADV7125
U7 = Microchip:PIC18(L)F4XK22
U8 = Micron:M25P40
U9 = FTDI Chip:FT232RL
U10 = Xilinx:XC6SLX9
U11 = ON Semiconductor:NCP566
U12 U13 U17 U18 = Texas Instruments:74LVC1T45
U15 = ON Semiconductor:NCP1117
U19 = Texas Instruments:TPD7S019
Y1 = ECS:OSC